# EAGLE design Adafruit ESP32-S3 8MB No PSRAM (EAGLE 9.6.2)
COMPANY: ADAFRUIT INDUSTRIES; DRAWN: KTOWN; REV: B

## Sheet 1 of 2
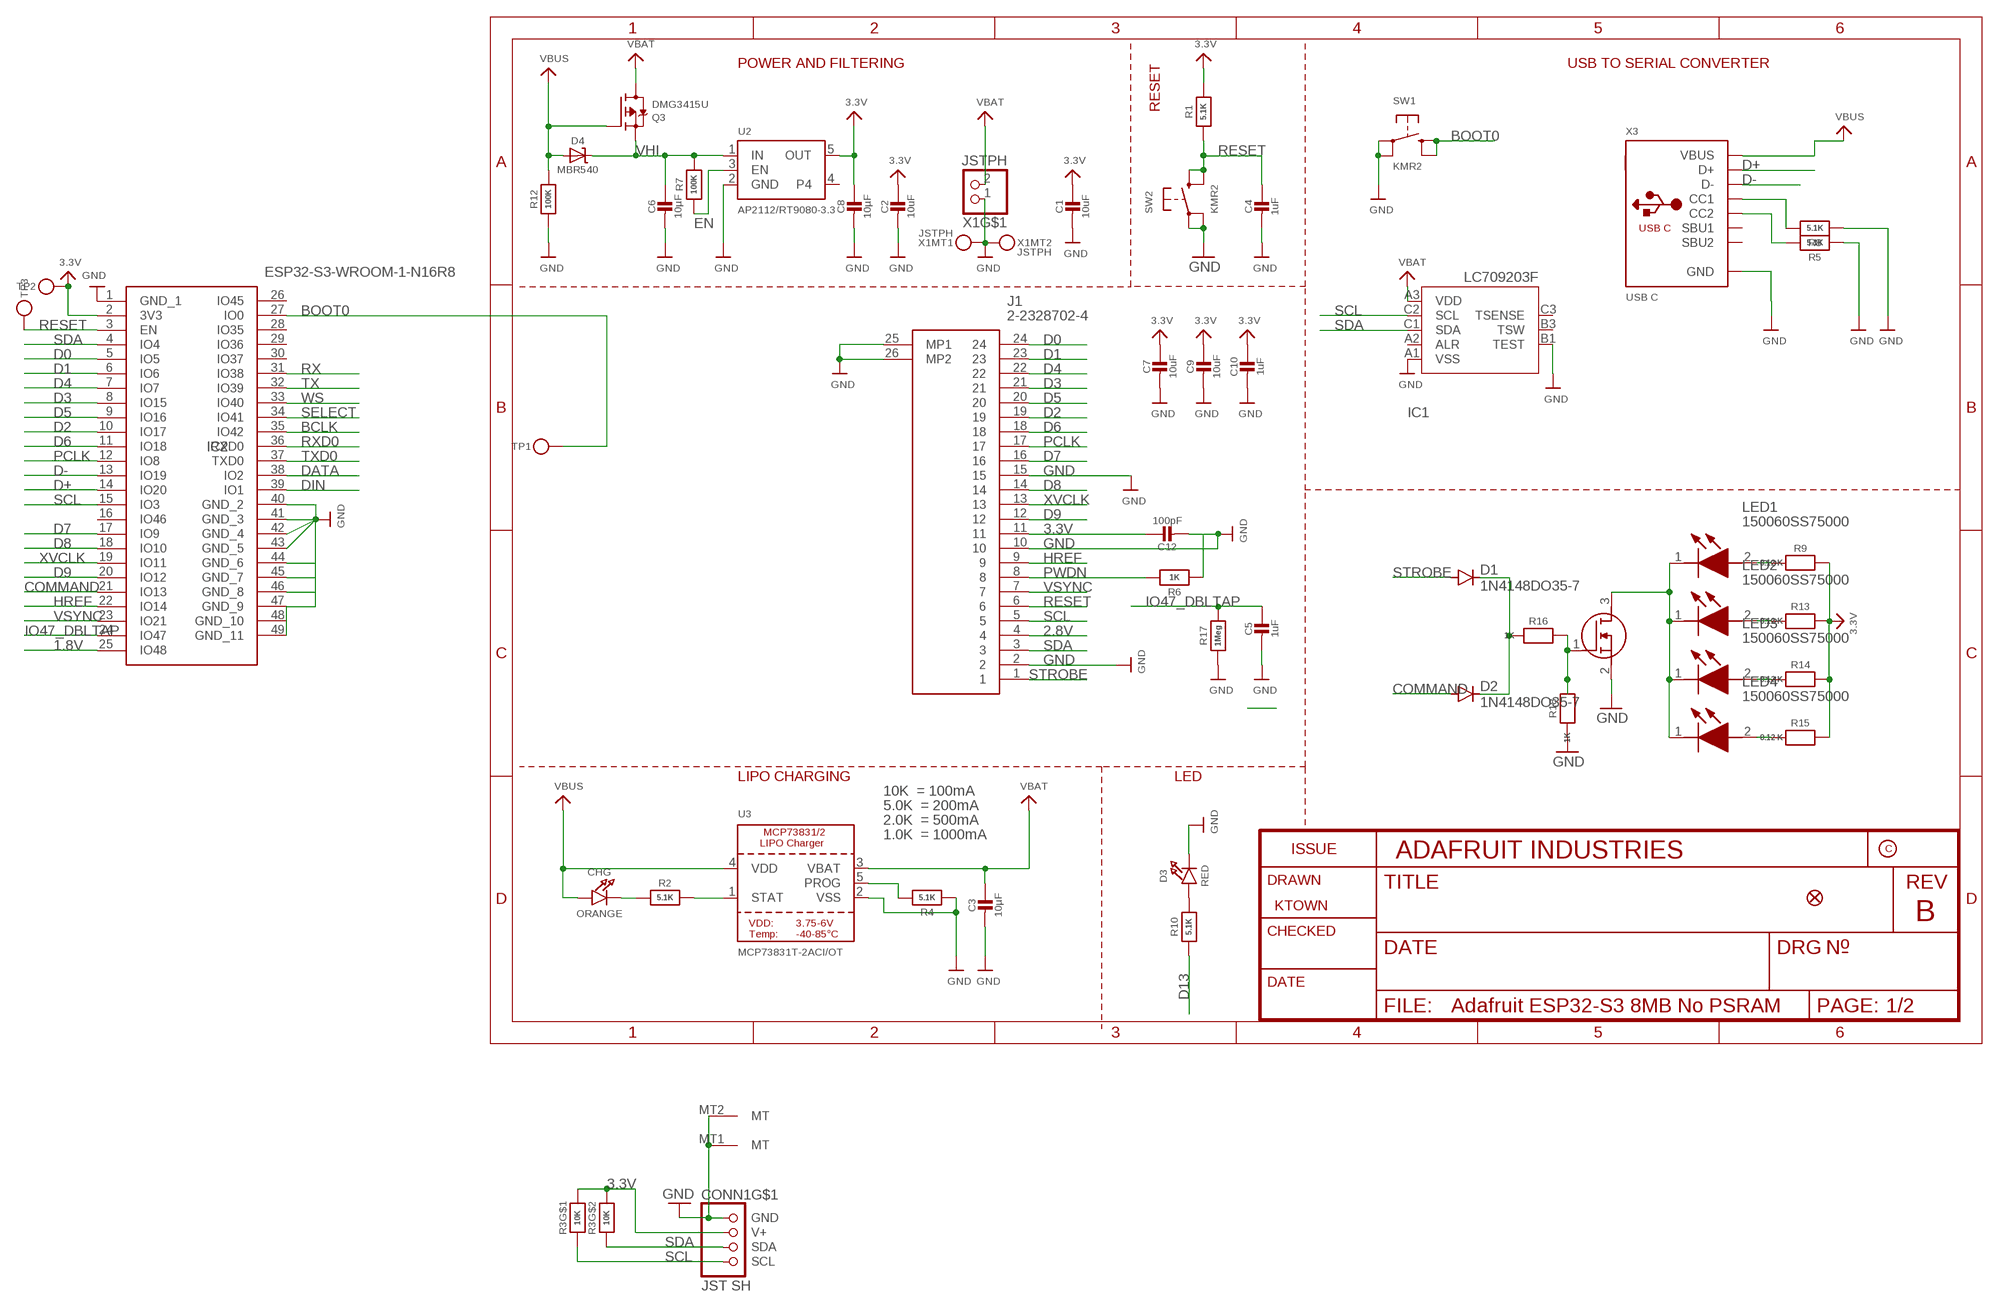
[diagram p0: schematic, sheet 1]

### Parts
C1  10uF  CAP_CERAMIC0805-NOOUTLINE  [0805-NO]
C2  10uF  CAP_CERAMIC0805-NOOUTLINE  [0805-NO]
C3  10µF  CAP_CERAMIC0805-NOOUTLINE  [0805-NO]
C4  1uF  CAP_CERAMIC0603_NO  [0603-NO]
C5  1uF  CAP_CERAMIC0603_NO  [0603-NO]
C6  10µF  CAP_CERAMIC0805-NOOUTLINE  [0805-NO]
C7  10uF  CAP_CERAMIC0805-NOOUTLINE  [0805-NO]
C8  10µF  CAP_CERAMIC0805-NOOUTLINE  [0805-NO]
C9  10uF  CAP_CERAMIC0805-NOOUTLINE  [0805-NO]
C10  1uF  CAP_CERAMIC0603_NO  [0603-NO]
C12  100pF  CAP_CERAMIC0805-NOOUTLINE  [0805-NO]
CHG  ORANGE  LED0603_NOOUTLINE  [CHIPLED_0603_NOOUTLINE]
CONN1  JST SH  STEMMA_I2C_QTRA  [JST_SH4_RA]
D1  1N4148DO35-7  [DO35-7]
D2  1N4148DO35-7  [DO35-7]
D3  RED  LED0603_NOOUTLINE  [CHIPLED_0603_NOOUTLINE]
D4  MBR540  DIODE-SCHOTTKYSOD-123  [SOD-123]
IC1  LC709203F/MH  [WLCSP9]
IC2  ESP32-S3-WROOM-1-N16R8  [ESP32S3WROOM1N16R8]
J1  2-2328702-4  [223287024]
LED1  150060SS75000  [LEDC1608X80N]
LED2  150060SS75000  [LEDC1608X80N]
LED3  150060SS75000  [LEDC1608X80N]
LED4  150060SS75000  [LEDC1608X80N]
Q2  2N7002  [SOT96P240X120-3N]
Q3  DMG3415U  MOSFET-P  [SOT23-R]
R1  5.1K  RESISTOR_0603_NOOUT  [0603-NO]
R2  5.1K  RESISTOR_0603_NOOUT  [0603-NO]
R3  10K  RESISTOR_4PACK  [RESPACK_4X0603]
R4  5.1K  RESISTOR_0603_NOOUT  [0603-NO]
R5  5.1K  RESISTOR_0603_NOOUT  [0603-NO]
R6  1K  RESISTOR_0603_NOOUT  [0603-NO]
R7  100K  RESISTOR_0603_NOOUT  [0603-NO]
R8  5.1K  RESISTOR_0603_NOOUT  [0603-NO]
R9  0.12 K  RESISTOR_0603_NOOUT  [0603-NO]
R10  5.1K  RESISTOR_0603_NOOUT  [0603-NO]
R12  100K  RESISTOR_0603_NOOUT  [0603-NO]
R13  0.12 K  RESISTOR_0603_NOOUT  [0603-NO]
R14  0.12 K  RESISTOR_0603_NOOUT  [0603-NO]
R15  0.12 K  RESISTOR_0603_NOOUT  [0603-NO]
R16  1K  RESISTOR_0603_NOOUT  [0603-NO]
R17  1Meg  RESISTOR_0603_NOOUT  [0603-NO]
R18  1K  RESISTOR_0603_NOOUT  [0603-NO]
SW1  KMR2  SWITCH_TACT_SMT4.6X2.8  [BTN_KMR2_4.6X2.8]
SW2  KMR2  SWITCH_TACT_SMT4.6X2.8  [BTN_KMR2_4.6X2.8]
TP1  TESTPOINTROUND1.5MMNO  [TESTPOINT_ROUND_1.5MM_NO]
TP2  TESTPOINTROUND1.5MMNO  [TESTPOINT_ROUND_1.5MM_NO]
TP3  TESTPOINTROUND1.5MMNO  [TESTPOINT_ROUND_1.5MM_NO]
U2  AP2112/RT9080-3.3  VREG_SOT23-5  [SOT23-5]
U3  MCP73831T-2ACI/OT  MCP73831/2  [SOT23-5]
U$34  FIDUCIAL_1MM  [FIDUCIAL_1MM]
X1  JSTPH  CON_JST_PH_2PIN_MT_BATT  [JSTPH2_BATT]
X3  USB C  USB_C  [USB_C_CUSB31-CFM2AX-01-X]

### Nets
1.8V: IC2.25(IO48)
2.8V: J1.4 ; also sheet 2
3.3V: C1.1 C2.1 C7.1 C8.1 C9.1 C10.1 C12.1 CONN1.2(V+) IC2.2(3V3) J1.11 R1.2 R3.7 R3.8 R9.2 R13.2 R14.2 R15.2 TP2.P$1 U2.5(OUT) ; also sheet 2
BCLK: IC2.35(IO42) ; also sheet 2
BOOT0: IC2.27(IO0) SW1.B'(S1) SW1.B(S) TP1.P$1
COMMAND: D2.A IC2.21(IO13)
D0: IC2.5(IO5) J1.24
D1: IC2.6(IO6) J1.23
D2: IC2.10(IO17) J1.19
D3: IC2.8(IO15) J1.21
D4: IC2.7(IO7) J1.22
D5: IC2.9(IO16) J1.20
D6: IC2.11(IO18) J1.18
D7: IC2.17(IO9) J1.16
D8: IC2.18(IO10) J1.14
D9: IC2.20(IO12) J1.12
D13: R10.1
D+: IC2.14(IO20) X3.A6(D+) X3.B6(D+)
D-: IC2.13(IO19) X3.A7(D-) X3.B7(D-)
DATA: IC2.38(IO2) ; also sheet 2
DIN: IC2.39(IO1) ; also sheet 2
EN: R7.1 U2.3(EN)
GND: C1.2 C2.2 C3.2 C4.2 C5.2 C6.2 C7.2 C8.2 C9.2 C10.2 C12.2 CONN1.1(GND) CONN1.MT1(MT) CONN1.MT2(MT) D3.C IC1.A1(VSS) IC1.B1(TEST) IC2.1(GND_1) IC2.40(GND_2) IC2.41(GND_3) IC2.42(GND_4) IC2.43(GND_5) IC2.44(GND_6) IC2.45(GND_7) IC2.46(GND_8) IC2.47(GND_9) IC2.48(GND_10) IC2.49(GND_11) J1.2 J1.10 J1.15 J1.25(MP1) J1.26(MP2) Q2.2(S) R4.1 R5.1 R6.1 R8.1 R12.1 R17.1 R18.1 SW1.A'(P1) SW1.A(P) SW2.A'(P1) SW2.A(P) U2.2(GND) U3.2(VSS) X1.1 X1.NC1 X1.NC2 X3.A1B12(GND) X3.B1A12(GND) ; also sheet 2
HREF: IC2.22(IO14) J1.9
IO47_DBLTAP: C5.1 IC2.24(IO47) R17.2
N$1: CHG.C R2.1
N$2: LED1.2(A) R9.1
N$3: R2.2 U3.1(STAT)
N$4: R4.2 U3.5(PROG)
N$5: D3.A R10.2
N$8: R8.2 X3.A5(CC1)
N$9: R5.2 X3.B5(CC2)
N$10: LED2.2(A) R13.1
N$11: LED3.2(A) R14.1
N$12: LED4.2(A) R15.1
N$13: LED1.1(K) LED2.1(K) LED3.1(K) LED4.1(K) Q2.3(D)
N$14: D1.C D2.C R16.1
N$15: Q2.1(G) R16.2 R18.2
PCLK: IC2.12(IO8) J1.17
PWDN: J1.8 R6.2
RESET: C4.1 IC2.3(EN) J1.6 R1.1 SW2.B'(S1) SW2.B(S) TP3.P$1
RX: IC2.31(IO38) ; also sheet 2
RXD0: IC2.36(RXD0) ; also sheet 2
SCL: CONN1.4(SCL) IC1.C2(SCL) IC2.15(IO3) J1.5 R3.1
SDA: CONN1.3(SDA) IC1.C1(SDA) IC2.4(IO4) J1.3 R3.2
SELECT: IC2.34(IO41) ; also sheet 2
STROBE: D1.A J1.1
TX: IC2.32(IO39) ; also sheet 2
TXD0: IC2.37(TXD0) ; also sheet 2
VBAT [Power]: C3.1 IC1.A3(VDD) Q3.3(D) U3.3(VBAT) X1.2
VBUS [Power]: CHG.A D4.A Q3.1(G) R12.2 U3.4(VDD) X3.A4B9(VBUS) X3.B4A9(VBUS)
VHI [Power]: C6.1 D4.C Q3.2(S) R7.2 U2.1(IN)
VSYNC: IC2.23(IO21) J1.7
WS: IC2.33(IO40) ; also sheet 2
XVCLK: IC2.19(IO11) J1.13
Unconnected: IC1.A2(ALR) IC1.B3(TSW) IC1.C3(TSENSE) IC2.16(IO46) IC2.26(IO45) IC2.28(IO35) IC2.29(IO36) IC2.30(IO37) R3.3 R3.4 R3.5 R3.6 U2.4 X3.A8(SBU1) X3.B8(SBU2)

### Notes on the sheet
- POWER AND FILTERING | USB TO SERIAL CONVERTER
- RESET
- LIPO CHARGING | LED
- 10K  = 100mA
- 5.0K  = 200mA
- 2.0K  = 500mA
- 1.0K  = 1000mA

## Sheet 2 of 2
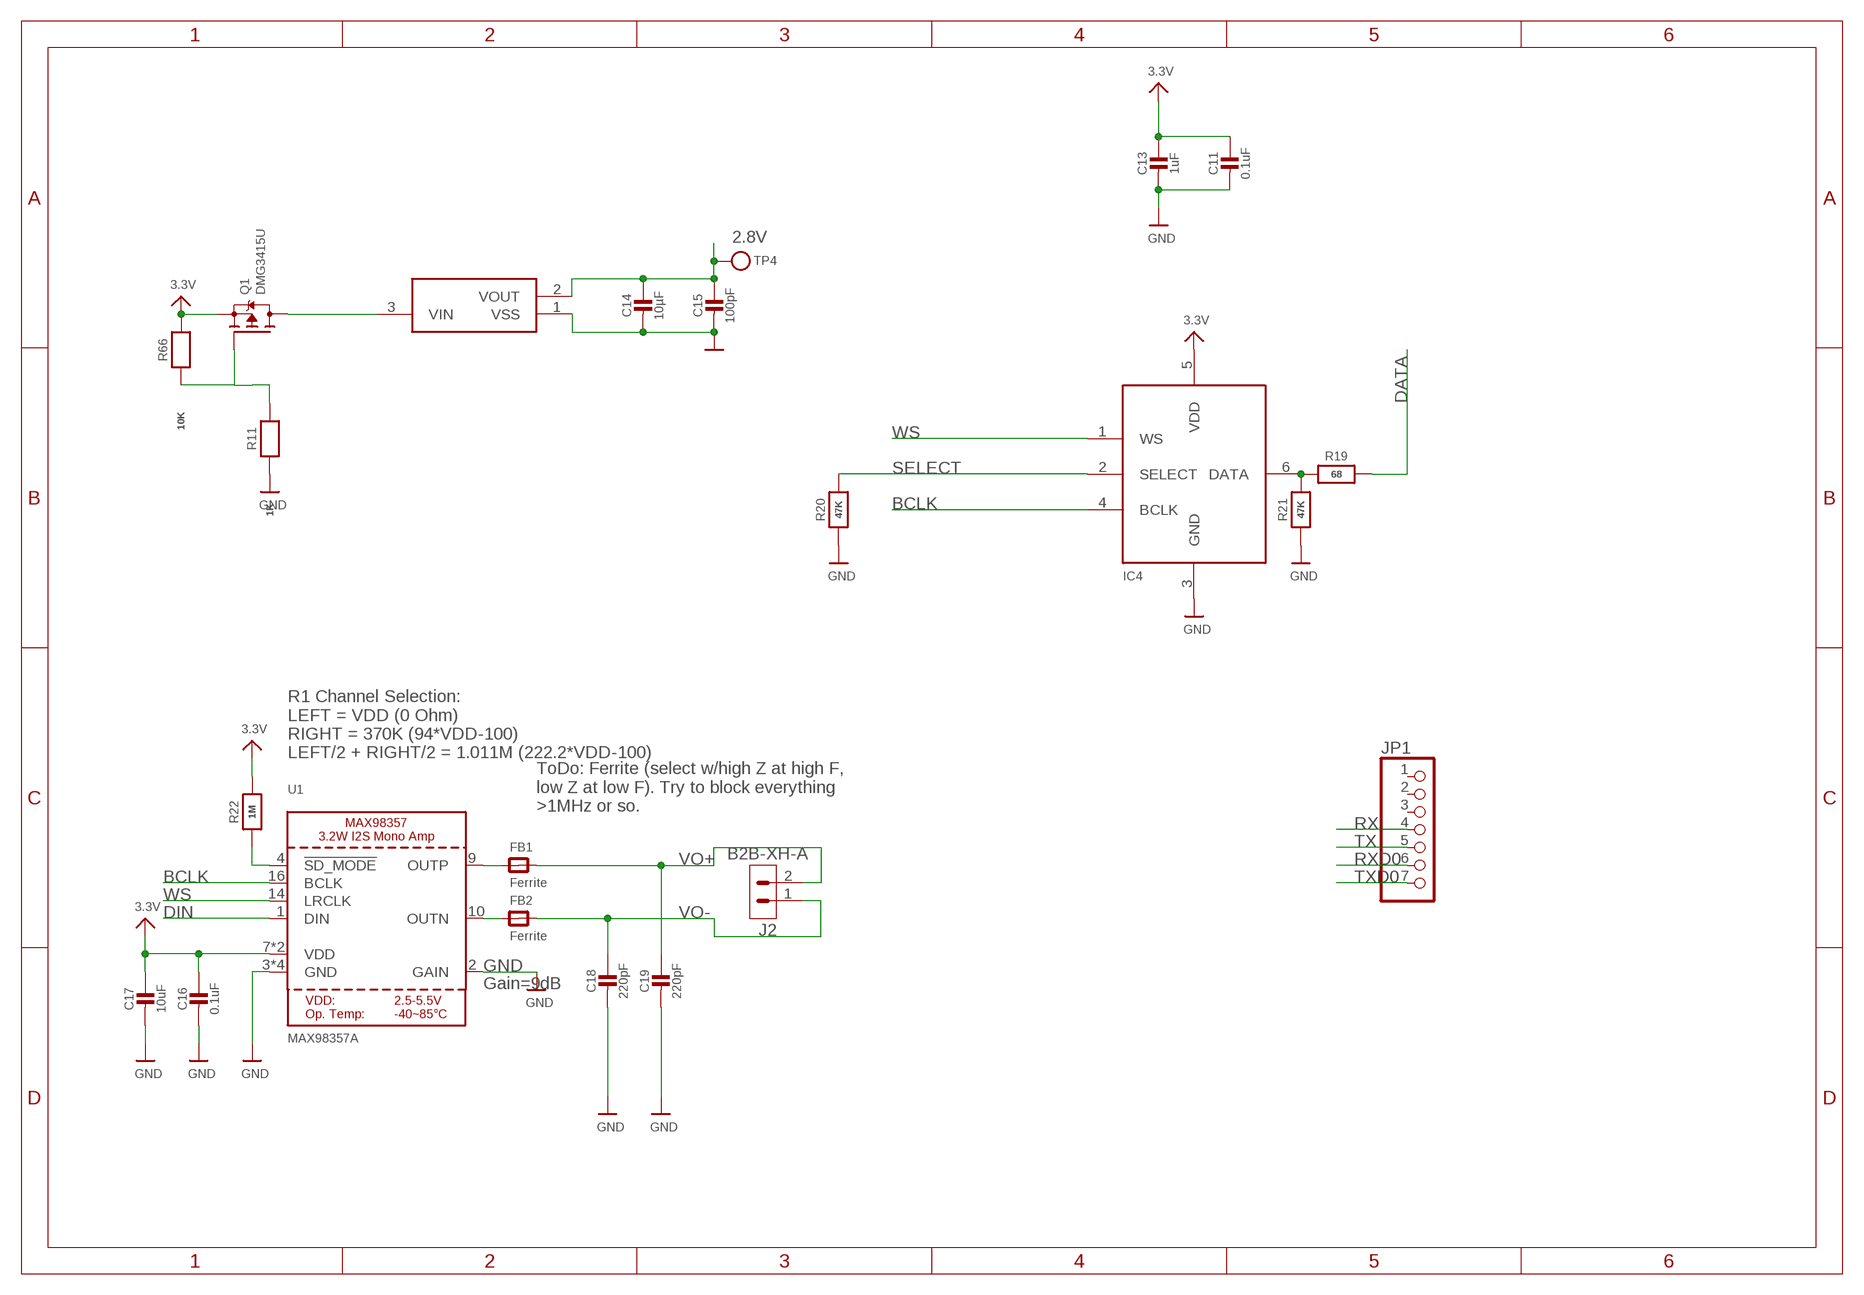
[diagram p1: schematic, sheet 2]

### Parts
C11  0.1uF  CAP_CERAMIC0603_NO  [0603-NO]
C13  1uF  CAP_CERAMIC0603_NO  [0603-NO]
C14  10µF  CAP_CERAMIC0805-NOOUTLINE  [0805-NO]
C15  100pF  CAP_CERAMIC0805-NOOUTLINE  [0805-NO]
C16  0.1uF  CAP_CERAMIC0805-NOOUTLINE  [0805-NO]
C17  10uF  CAP_CERAMIC0805-NOOUTLINE  [0805-NO]
C18  220pF  CAP_CERAMIC0805-NOOUTLINE  [0805-NO]
C19  220pF  CAP_CERAMIC0805-NOOUTLINE  [0805-NO]
FB1  Ferrite  FERRITE-0805NO  [0805-NO]
FB2  Ferrite  FERRITE-0805NO  [0805-NO]
IC3  XC6206P282MR-G  [SOT95P280X130-3N]
IC4  ICS-43434  MIC_I2S_SPH0645  [SPH0645LM4H]
J2  B2B-XH-A  [B2B-XH-A]
JP1  HEADER-1X7THICKER  [1X07_ROUND_76]
Q1  DMG3415U  MOSFET-P  [SOT23-R]
R11  1K  RESISTOR_0603_NOOUT  [0603-NO]
R19  68  RESISTOR_0603_NOOUT  [0603-NO]
R20  47K  RESISTOR_0603_NOOUT  [0603-NO]
R21  47K  RESISTOR_0603_NOOUT  [0603-NO]
R22  1M  RESISTOR0805_NOOUTLINE  [0805-NO]
R66  10K  RESISTOR_0603_NOOUT  [0603-NO]
TP4  TESTPOINTROUND1.5MMNO  [TESTPOINT_ROUND_1.5MM_NO]
U1  MAX98357A  AUDIOAMP_MAX98357  [QFN16_3MM]

### Nets
2.8V: C14.1 C15.1 IC3.2(VOUT) TP4.P$1 ; also sheet 1
3.3V: C11.1 C13.1 C16.1 C17.1 IC4.5(VDD) Q1.2(S) R22.2 R66.2 U1.7(VDD) U1.8(VDD) ; also sheet 1
BCLK: IC4.4(BCLK) U1.16(BCLK) ; also sheet 1
DATA: R19.2 ; also sheet 1
DIN: U1.1(DIN) ; also sheet 1
GND: C11.2 C13.2 C14.2 C15.2 C16.2 C17.2 C18.2 C19.2 IC3.1(VSS) IC4.3(GND) R11.1 R20.1 R21.1 U1.2(GAIN) U1.3(GND) U1.11(GND) U1.15(GND) U1.THERMAL(GND) ; also sheet 1
N$6: Q1.1(G) R11.2 R66.1
N$7: IC3.3(VIN) Q1.3(D)
N$17: IC4.6(DATA) R19.1 R21.2
N$18: FB2.1 U1.10(OUTN)
N$19: FB1.1 U1.9(OUTP)
RX: JP1.4 ; also sheet 1
RXD0: JP1.6 ; also sheet 1
SD_MODE: R22.1 U1.4(!SD_MODE)
SELECT: IC4.2(SELECT) R20.2 ; also sheet 1
TX: JP1.5 ; also sheet 1
TXD0: JP1.7 ; also sheet 1
VO+: C19.1 FB1.2 J2.2
VO-: C18.1 FB2.2 J2.1
WS: IC4.1(WS) U1.14(LRCLK) ; also sheet 1
Unconnected: JP1.1 JP1.2 JP1.3

### Notes on the sheet
- R1 Channel Selection:
  LEFT = VDD (0 Ohm)
  RIGHT = 370K (94*VDD-100)
  LEFT/2 + RIGHT/2 = 1.011M (222.2*VDD-100)
- ToDo: Ferrite (select w/high Z at high F,
  low Z at low F). Try to block everything
  >1MHz or so.
- Gain=9dB

## Library data of the parts
C1-C7 C9-C19 = microbuilder:CAP_CERAMIC: Ceramic Capacitors For new designs, use the packages preceded by an '_' character since they are more reliable: The following footprints should be used on most boards: _0402 - Standard footprint for regular board layouts _0603 - Standard footprint for regular board layouts _0805 - Standard footprint for regular board layouts _1206 - Standard footprint for regular board layouts For extremely tight-pitch boards where space is at a premium, the following 'micro-pitch' footprints can be used (smaller pads, no silkscreen outline, etc.): _0402MP - Micro-pitch footprint for very dense/compact boards _0603MP - Micro-pitch footprint for very dense/compact boards _0805MP - Micro-pitch footprint for very dense/compact boards _1206MP - Micro-pitch footprint for very dense/compact boards
C8 = microbuilder:CAP_CERAMIC: Ceramic Capacitors For new designs, use the packages preceded by an '_' character since they are more reliable: The following footprints should be used on most boards: _0402 - Standard footprint for regular board layouts _0603 - Standard footprint for regular board layouts _0805 - Standard footprint for regular board layouts _1206 - Standard footprint for regular board layouts For extremely tight-pitch boards where space is at a premium, the following 'micro-pitch' footprints can be used (smaller pads, no silkscreen outline, etc.): _0402MP - Micro-pitch footprint for very dense/compact boards _0603MP - Micro-pitch footprint for very dense/compact boards _0805MP - Micro-pitch footprint for very dense/compact boards _1206MP - Micro-pitch footprint for very dense/compact boards; REV: C
CHG D3 = microbuilder:LED: LED 0603 - 0603 Surface Mount Package 2mA: Green LED - Low Power (3.9mcd, 2ma, 1.7Vf) - Digikey: 475-2709-2-ND Orange LED - Low Power (9.8mcd, 2ma, 1.8Vf) - Digikey: 475-1194-2-ND Red LED - Low Power (5mcd, 2ma, 1.8Vf) - Digikey: 475-1195-2-ND Yellow LED - Low Power (7mcd, 2ma, 1.8Vf) - Digikey: 475-1196-2-ND 5mA: Blue LED - Low Power (17mcd, 5ma, 2.9Vf) - Digikey: LNJ937W8CRACT-ND 0805 - 0805 Surface Mount Package 2mA: Red LED (8.8mcd, 2mA, 1.8Vf, Clear) - Low Power [Digikey: 475-2510-1-ND] Green LED (5mcd, 2mA, 1.8Vf, Clear) - Low Power [Digikey: 475-2730-1-ND] Yellow LED (11.3mcd, 2mA, 1.8Vf, Clear) - Low Power [Digikey: 475-2555-1-ND] 20mA: Red LED (104mcd, 20mA, Diffused) - LS R976 [Digikey: 475-1278-6-ND] Red LED (12mcd, 20mA, 2.0Vf, Clear) - APT2012EC [Digikey: 754-1128-1-ND] Green LED (15mcd, 20mA, 2.2Vf, Clear) - APT2012GC [Digikey: 754-1131-1-ND] Orange LED (160mcd, 20mA, 2.1Vf, Clear) - APT2012SECK [Digikey: 754-1130-1-ND] 1206 - 1206 Surface Mount Package Green LED (26mcd, 20mA, Diffused) - LG N971 [Digikey: 475-1407-6-ND] Red LED (15mcd, 20mA, Diffused) - LH N974 [Digikey: 475-1416-6-ND] Cree - Cree High-Power Surface Mount LEDs XPEBWT-L1-0000-00D50 - White 111lm 350mA 2.9Vf 6200K 110° XTEAWT-00-0000-00000LEE3 - White 114lm 350mA 2.85Vf 5000K 115° Everlight - Everlight 45-21 Series Surface Mount LEDs 45-21/QK2C-B2832AC2CB2/2T - Warm White 2000mcd 20mA 3.25Vf 3050K 120° 45-21/LK2C-B38452C4CB2/2T - Nuetral White 2000mcd 20mA 3.25Vf 4150K 120° 45-21/LK2C-B50634C6CB2/2T - Cold White 2200mcd 20mA 3.25Vf 5650K 120° PLCC2 Reverse Mount LS T77K-J1L2-1-0-2-R18-Z - Red 11.25mcd 2mA 1.8Vf 630nm 120° LO T77K-L1M2-24-Z - Orange 19.6mcd 2mA 1.8Vf 606nm 120° LY T77K-K2M1-26-Z - Yellow 15.7mcd 2mA 1.8Vf 587nm 120°
CONN1 = microbuilder:STEMMA_I2C
D1 D2 = diode:1N4148: DIODE high speed (Philips)
D4 = microbuilder:DIODE-SCHOTTKY
FB1 FB2 = microbuilder:FERRITE: Ferrite Bead 0603 MMZ1608B121C - 120 Ohm @ 100MHz, 600mA, 0.15 Ohm DC Resistance - Digikey: 445-2164-1-ND BK1608HW121-T - 120 Ohm, 600mA Ferrite Chip - Digikey: 587-1876-2-ND 0805 HZ0805B272R-10 - 2.7K Ohm @ 100MHz, 200mA, 0.8 Ohm DC Resistance - Digikey: 240-2504-1-ND (see also Murata BLM21BD272SN1L) MMZ2012Y152B - 1.5K Ohm @ 100MHz, 500mA, 0.4 Ohm DC Resistance - Digikey: 445-1560-1-ND - Mainly for high frequency (80-400MHz) MMZ2012R102A - 1K Ohm @ 100MHz, 500mA, 0.3 Ohm DC Resistance - Digikey: 445-1555-2-ND - More general purpose (10-200MHz)
IC1 = adafruit_sensor:LC709203F
IC2 = SamacSys_Parts:ESP32-S3-WROOM-1-N16R8: Multiprotocol Modules SMD Module, ESP32-S3R8, 3.3V, 8 MB Octal PSRAM Die, 16 MB Quad SPI Flash, PCB Antenna Source: Datasheet <https://www.espressif.com/sites/default/files/documentation/esp32-s3-wroom-1_wroom-1u_datasheet_en.pdf>; DESCRIPTION: Multiprotocol Modules SMD Module, ESP32-S3R8, 3.3V, 8 MB Octal PSRAM Die, 16 MB Quad SPI Flash, PCB Antenna; HEIGHT: 3.25mm; MANUFACTURER_NAME: Espressif Systems; MANUFACTURER_PART_NUMBER: ESP32-S3-WROOM-1-N16R8; MOUSER_PART_NUMBER: 356-ESP32S3WRM1N16R8; MOUSER_PRICE-STOCK: https://www.mouser.co.uk/ProductDetail/Espressif-Systems/ESP32-S3-WROOM-1-N16R8?qs=Li%252BoUPsLEnvQc9gW6AMhZg%3D%3D
IC3 = SamacSys_Parts:XC6206P282MR-G: LDO Voltage Regulators 1uA Low Quiescent 3 Terminal, Low ESR Cap. Compatible, Voltage Regulator Source: Datasheet <https://www.torexsemi.com/file/xc6206/XC6206.pdf>; DESCRIPTION: LDO Voltage Regulators 1uA Low Quiescent 3 Terminal, Low ESR Cap. Compatible, Voltage Regulator; HEIGHT: 1.3mm; MANUFACTURER_NAME: Torex; MANUFACTURER_PART_NUMBER: XC6206P282MR-G; MOUSER_PART_NUMBER: 865-XC6206P282MR-G; MOUSER_PRICE-STOCK: https://www.mouser.co.uk/ProductDetail/Torex-Semiconductor/XC6206P282MR-G?qs=AsjdqWjXhJ%2Fpd3DOBopSeA%3D%3D
IC4 = microbuilder:MIC_I2S
J1 = SamacSys_Parts:2-2328702-4: 24 Position FPC Connector Contacts, Top and Bottom 0.020" (0.50mm) Surface Mount, Right Angle Source: Datasheet <https://www.te.com/commerce/DocumentDelivery/DDEController?Action=srchrtrv&DocNm=2328702&DocType=Customer Drawing&DocLang=English&DocFormat=pdf&PartCntxt=2-2328702-4>; DESCRIPTION: 24 Position FPC Connector Contacts, Top and Bottom 0.020" (0.50mm) Surface Mount, Right Angle; HEIGHT: 1.21mm; MANUFACTURER_NAME: TE Connectivity; MANUFACTURER_PART_NUMBER: 2-2328702-4; MOUSER_PART_NUMBER: 571-2-2328702-4; MOUSER_PRICE-STOCK: https://www.mouser.co.uk/ProductDetail/TE-Connectivity/2-2328702-4?qs=P1JMDcb91o4XHtVyXYd2Ug%3D%3D
J2 = Connector:B2B-XH-A: XH Connector Top Entry - 2POS Reference: : Datasheet <http://www.jst-mfg.com/product/pdf/eng/eXH.pdf>; CATEGORY: Connectors; DATASHEET: https://www.jst-mfg.com/product/pdf/eng/eXH.pdf; DESCRIPTION: Connector Header Through Hole 2 position 0.098" (2.50mm); MANUFACTURER: JST Sales America Inc.; MPN: B2B-XH-A; OPERATING_TEMPERATURE: -25°C ~ 85°C; PACKAGE_SIZE: NA; PACKAGE_TYPE: Through Hole; PART_STATUS: Active; PITCH: 0.098" (2.50mm); ROHS: Compliant; SERIES: XH; SUBCATEGORY: Rectangular Connectors; TYPE: Male Headers
JP1 = microbuilder:HEADER-1X7: PIN HEADER
LED1-LED4 = SamacSys_Parts:150060SS75000: WL-SMCW SMT Mono-Color Chip LED Waterclear 0603, Super Red Typ.(@20mA): 630nm, 60mcd, 1.9V, 140 AlInGaP Source: Datasheet <https://www.we-online.com/catalog/datasheet/150060SS75000.pdf>; DESCRIPTION: WL-SMCW SMT Mono-Color Chip LED Waterclear 0603, Super Red Typ.(@20mA): 630nm, 60mcd, 1.9V, 140 AlInGaP; HEIGHT: 0.8mm; MANUFACTURER_NAME: Wurth Elektronik; MANUFACTURER_PART_NUMBER: 150060SS75000; MOUSER_PART_NUMBER: 710-150060SS75000; MOUSER_PRICE-STOCK: https://www.mouser.co.uk/ProductDetail/Wurth-Elektronik/150060SS75000?qs=LlUlMxKIyB0oQaxwspeTEA%3D%3D
Q1 Q3 = microbuilder:MOSFET-P: P-Channel Mosfet LEGEND VDS: Voltage Drain-Source ID: Drain Current RDS(ON): Drain-Source On-State Resistance VGS(TH): Gate-Source Threshold Voltage CISS: Drain-Source Input Capacitance SOT-23 Name VDS ID RDS(ON) VGS(TH) CISS Order Number IRLML5103 30V 760mA 600 mOhm -- 75pF @ 25V Digikey: IRLML5103PBFCT-ND IRLML6401 12V 4.3A 50 mOhm 950mV @ 250µA 830pF @ 10V Digikey: IRLML6401PBFTR-ND NTR0202PL 20V 400mA 800 mOhm 2.3V @ 250uA 70pF @ 5V Digikey: NTR0202PLT1GOSTR-ND NTR4101PT1G 20V 1.8A 85 mOhm 1.2V @ 250uA 675pF @ 10V Digikey: NTR4101PT1GOSCT-ND DMP2004K 20V 600mA 900 mOhm 1V @ 250uA 175pF @ 16V Digikey: DMP2004KDICT-ND PMV65XP 20V 3.9A 76 mOhm 950mV @ 1mA 725pF @ 20V Digikey: 568-2358-2-ND TO-252 Name VDS ID RDS(ON) VGS(TH) CISS Order Number AOD417 30V 25A 34 mOhm 3V @ 250µA 920pF @ 15V Digikey: 785-1106-2-ND PowerPak Name VDS ID RDS(ON) VGS(TH) CISS Order Number AON7401 30V 12A 14 mOhm 3V @ 250µA 2600pF @ 15V Digikey: 785-1302-1-ND
Q2 = SamacSys_Parts:2N7002: Voltage controlled small signal switch.; High density cell design for extremely low RDS(ON).; Rugged and Reliable.; High saturation current capability. Source: Datasheet <https://www.onsemi.com/pub/Collateral/NDS7002A-D.PDF>; DESCRIPTION: Voltage controlled small signal switch.; High density cell design for extremely low RDS(ON).; Rugged and Reliable.; High saturation current capability.; HEIGHT: 1.2mm; MANUFACTURER_NAME: onsemi; MANUFACTURER_PART_NUMBER: 2N7002; MOUSER_PART_NUMBER: 512-2N7002; MOUSER_PRICE-STOCK: https://www.mouser.co.uk/ProductDetail/onsemi-Fairchild/2N7002?qs=0dwsXDNhqlz66WJJhrTFjQ%3D%3D
R1 R2 R4-R22 R66 = microbuilder:RESISTOR: Resistors For new designs, use the packages preceded by an '_' character since they are more reliable: The following footprints should be used on most boards: _0402 - Standard footprint for regular board layouts _0603 - Standard footprint for regular board layouts _0805 - Standard footprint for regular board layouts _1206 - Standard footprint for regular board layouts For extremely tight-pitch boards where space is at a premium, the following 'micro-pitch' footprints can be used (smaller pads, no silkscreen outline, etc.): _0402MP - Micro-pitch footprint for very dense/compact boards _0603MP - Micro-pitch footprint for very dense/compact boards _0805MP - Micro-pitch footprint for very dense/compact boards _1206MP - Micro-pitch footprint for very dense/compact boards
R3 = microbuilder:RESISTOR_4PACK: Resistor Packs (4 resistors) 4 x 0603 10K 1/16W - Digikey: YC164J-10KCT-ND
SW1 SW2 = microbuilder:SWITCH_TACT_SMT: SMT Tact Switches 6x6mm - Digikey: P12940SCT-ND KMR2 (4.6x2.8mm) - Digikey: 401-1426-1-ND EVQ-PQHB55 - Light Touch, 160GF (4.5x4.5mm) - Digikey: P8090SCT-ND KMT0 - KMT021 NGJ LHS (etc.) IP68/Waterproof - Digikey: CKN10289CT-ND
TP1-TP4 = microbuilder:TESTPOINT: Test Point Various test points for characterisation and PCB testing TESTPOINT_SMT - Compact Surface Mount Test Point [Digikey: 5016KTR-ND]
U1 = microbuilder:AUDIOAMP_MAX98357: MAX98357 - 3.2W I2S Mono Audio Amp
U2 = microbuilder:VREG_SOT23-5: SOT23-5 Fixed Voltage Regulators Part Current Out V Out V In V Dropout θJA (°C/W) TJ (°C) Digikey Part No. ADP121 150mA 3.3V 3.4-5.5V 0.09V @ 150mA -- -- ADP121-AUJZ33R7CT-ND ADP121 150mA 3.0V 3.1-5.5V 0.09V @ 150mA -- -- ADP121-AUJZ30R7CT-ND ADP122 300mA 3.3V 3.4-5.5V 0.085V @ 300mA -- -- ADP122AUJZ-3.3-R7CT-ND ADP1712 300mA 3.3V 3.5-5.5V 0.17V @ 300mA -- -- ADP1712AUJZ-3.3-R7TR-ND AP7311 (Low Cost) 150mA 3.3V 3.5-6V 0.15V @ 150mA -- -- AP7311-33WG-7DICT-ND LD39015M18R 150mA 1.8V 1.9V-5.5V 0.08V @ 100mA -- -- 497-6977-1-ND LP2985A-33DBVR 150mA 3.3V 3.3-16V 0.28V @ 150mA 206 150 296-18479-1-ND MCP1824T-3302E/OT 300mA 3.3V 3.5V-6V 0.2V @ 300mA -- -- MCP1824T-3302E/OTCT-ND MIC5205-2.5YM5 TR 150mA 2.5V 2.7-16V 0.165V @ 150mA -- -- 576-1257-2-ND MIC5205-3.0YM5 TR 150mA 3.0V 3.2V-16V 0.165V @ 150mA -- -- 576-1258-2-ND MIC5205-3.3YM5 TR 150mA 3.3V 3.5V-16V 0.165V @ 150mA -- -- 576-1259-2-ND TPS780330220 150mA 3.3V+2.2V 3.6-5.5V 250mV Max -- -- 296-23332-1-ND TDA3663/N1,135 100mA 3.3V 3.5-45V 0.18V @ 50mA -- -- 568-5343-1-ND Max operating temp can be calculated using θJA, TJ (max junction temperature), and power in watts. Set the "Maximum Ambient Temperature" until it reaches TJ ("Max Junction Temperature"), which is the absolute limit for safe use of the regulator: Heat Sink Temperature Calculator <http://www.daycounter.com/Calculators/Heat-Sink-Temperature-Calculator.phtml> For example, With 12V source into a 3.3V LP2985 and a 30mA load, we are dissipating (12V-3.3V) * 0.03A = 0.261W. With a θJA of 206 °C/W, a TJ of 150°C, and 261mW we can safely use the chip without a heat sink up to 75°C (=147.1°C Junction Temperature).
U3 = microbuilder:MCP73831/2: MCP73831/2 LIPO Charger VDD: 3.75 - 6V Temp -40 - 85°C Programmable Charge Rate: 15-500mA NOTE: STAT is a tri-state logic output on the MCP73831 and an open-drain output on the MCP73832. SOT23-5 with 4.2V output and tri-state logic on STAT = MCP73831T-2ACI/OT
U$34 = microbuilder:FIDUCIAL: Fiducial Alignment Points Various fiducial points for machine vision alignment.; BOM: EXCLUDE
X1 = adafruit_electromech:CON_JST_PH_2PIN_MT
X3 = adafruit_connector:USB_C: USB Type-C USB 2.0 Connector

## Net classes
2 gnd: width 0.254 mm, drill 0.483 mm
3 Power: width 0.305 mm, drill 0.483 mm

## Board
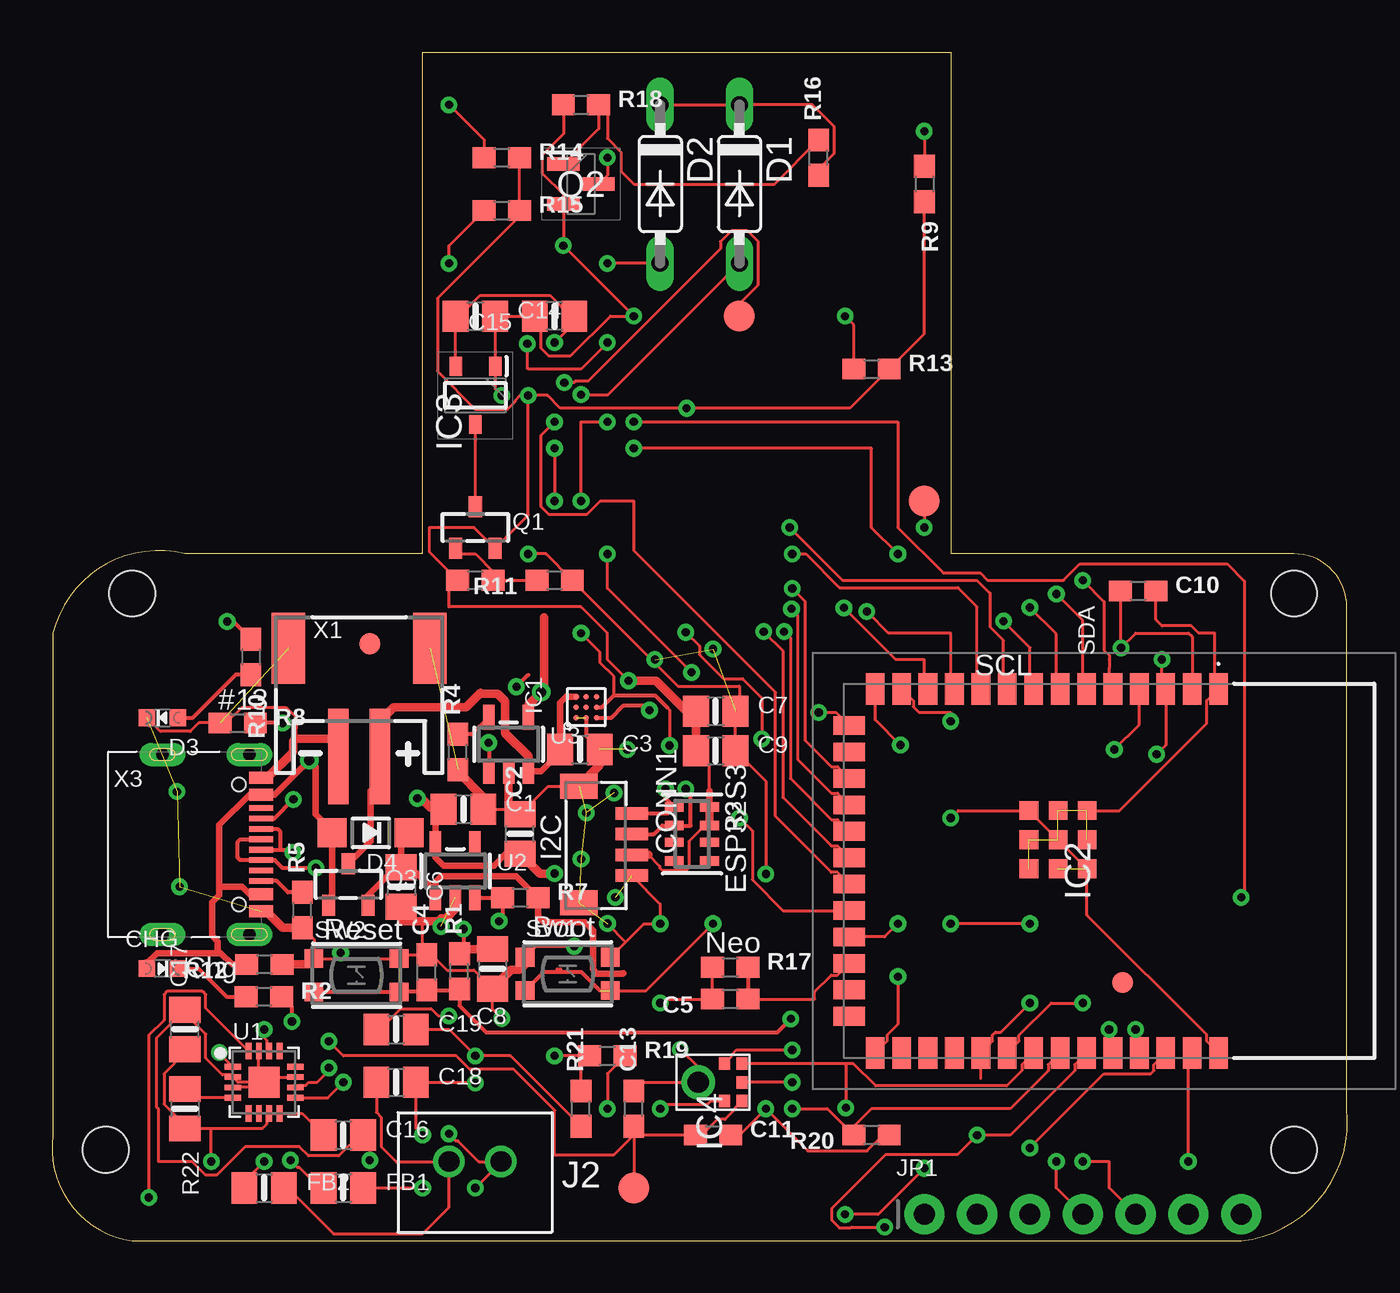
[diagram p2: board, top side]
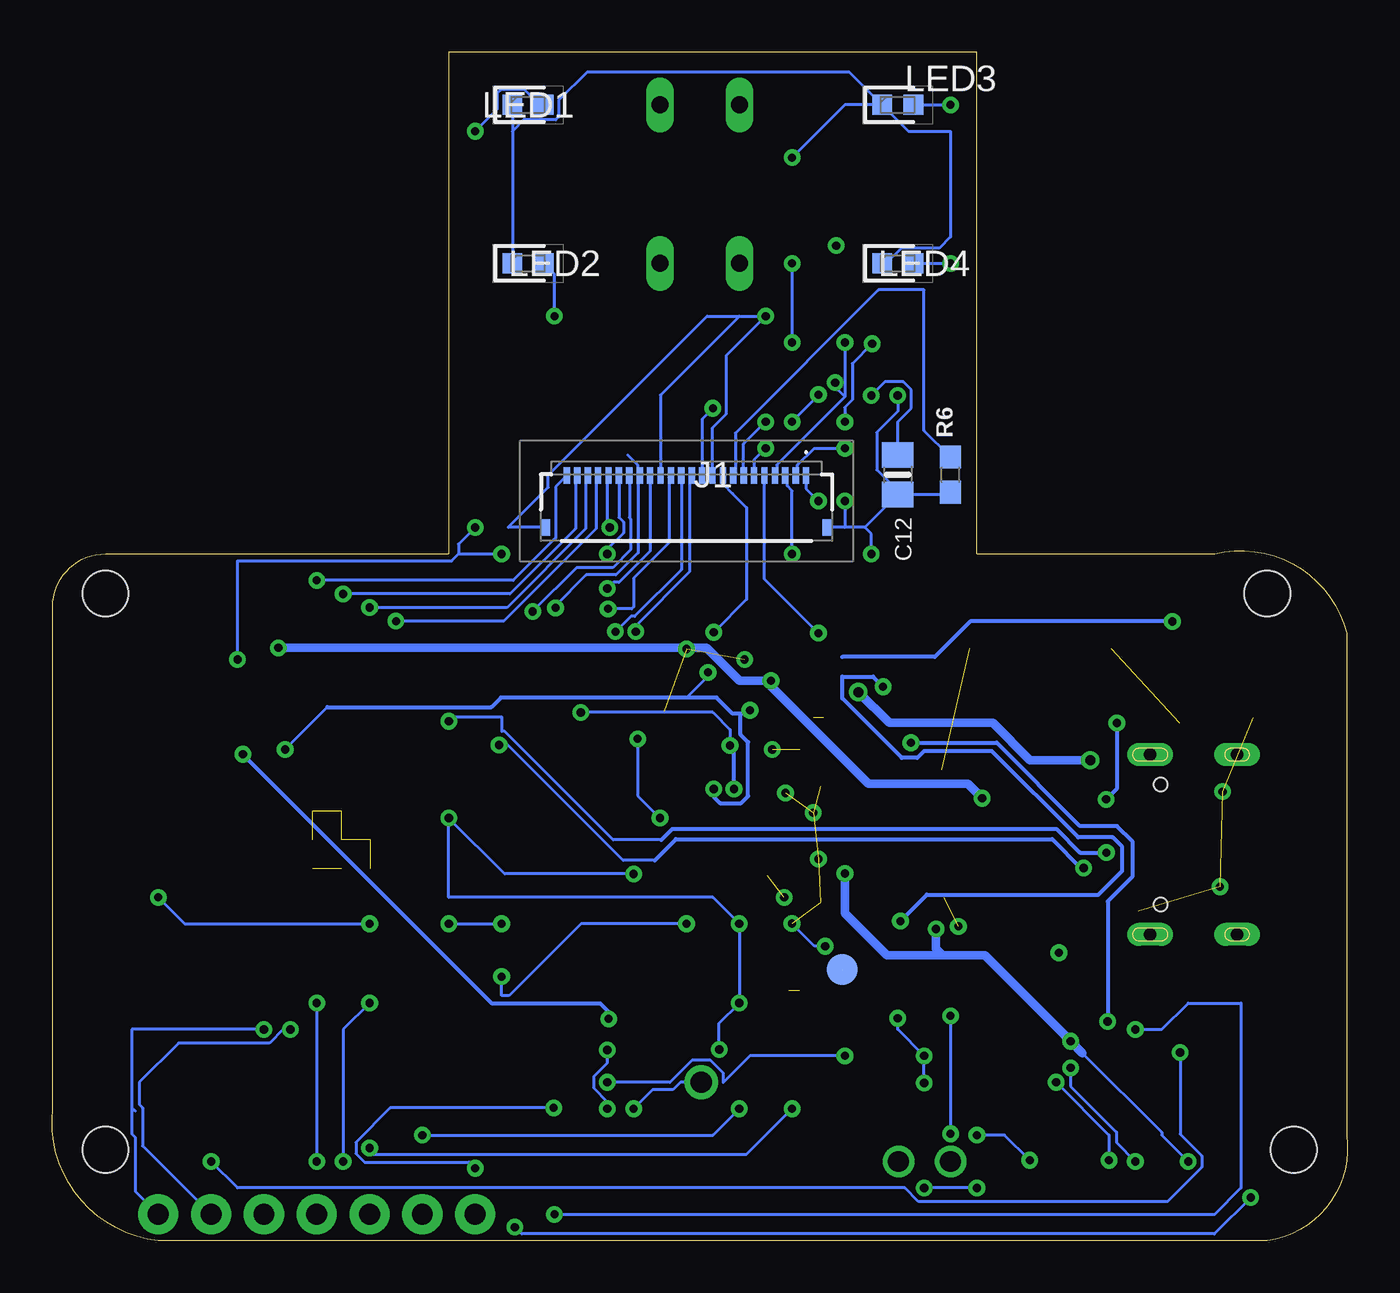
[diagram p3: board, bottom side, seen from below]

Size 62.31 x 57.15 mm. Coordinates in mm from the lower left corner, seen from the top.
Outline: 3.85,0 57.19,0 arc90 62.27,6.35 62.27,30.48 arc90 59.73,33.02 43.22,33.02 43.22,57.15 17.82,57.15 17.82,33.02 6.39,33.02 arc90 0.04,29.21 0.04,5.08 arc90 3.85,0
Copper layers (1*16): Top 0.035mm / dielectric 1.5mm / Bottom 0.035mm
Design rules "adafruit 7-7 *": minimum track width 6mil, minimum drill 15.5mil, track to track 8mil, track to pad 7mil, pad to pad 7mil, via to via 7mil, smd to smd 7mil, copper to edge 10mil, drill to drill 8mil, minimum pad ring 10mil, minimum via ring 8mil, stop-mask expansion 2mil, vias tented up to drill 20mil, thermal gap 10mil
Holes 2.2 mm at 59.73,4.38 59.73,31.11 2.58,4.38 3.85,31.11

### Footprints (pad centres in the part's own frame; a part is rotated, then mirrored left to right if it is on the bottom)
0805-NO = smd 1.24 x 1.5: 1 -0.95,0; 2 0.95,0
0603-NO = smd 1.1 x 1: 1 -0.85,0; 2 0.85,0
CHIPLED_0603_NOOUTLINE = smd 0.8 x 0.8: A 0,-0.75; C 0,0.75
JST_SH4_RA = smd 0.6 x 1.55: 1 1.5,1.686; 2 0.5,1.686; 3 -0.5,1.686; 4 -1.5,1.686 | smd 1.2 x 1.8: MT1 -2.8,-0.862; MT2 2.8,-0.862
DO35-7 = drill 0.813 long: A 3.81,0; C -3.81,0
SOD-123 = smd 1.4 x 1.4: A 1.85,0; C -1.85,0
WLCSP9 = smd 0.275 x 0.275: A1 -0.5,0.5; A2 0,0.5; A3 0.5,0.5; B1 -0.5,0; B2 0,0; B3 0.5,0; C1 -0.5,-0.5; C2 0,-0.5; C3 0.5,-0.5
ESP32S3WROOM1N16R8 = smd 1.5 x 0.9: 1 -8.75,5.26; 2 -8.75,3.99; 3 -8.75,2.72; 4 -8.75,1.45; 5 -8.75,0.18; 6 -8.75,-1.09; 7 -8.75,-2.36; 8 -8.75,-3.63; 9 -8.75,-4.9; 10 -8.75,-6.17; 11 -8.75,-7.44; 12 -8.75,-8.71; 13 -8.75,-9.98; 14 -8.75,-11.25; 27 8.75,-11.25; 28 8.75,-9.98; 29 8.75,-8.71; 30 8.75,-7.44; 31 8.75,-6.17; 32 8.75,-4.9; 33 8.75,-3.63; 34 8.75,-2.36; 35 8.75,-1.09; 36 8.75,0.18; 37 8.75,1.45; 38 8.75,2.72; 39 8.75,3.99; 40 8.75,5.26 | smd 0.9 x 1.5: 15 -6.985,-12.5; 16 -5.715,-12.5; 17 -4.445,-12.5; 18 -3.175,-12.5; 19 -1.905,-12.5; 20 -0.635,-12.5; 21 0.635,-12.5; 22 1.905,-12.5; 23 3.175,-12.5; 24 4.445,-12.5; 25 5.715,-12.5; 26 6.985,-12.5 | smd 0.9 x 0.9: 41 -1.5,-2.46; 42 -2.9,-1.06; 43 -2.9,-2.46; 44 -2.9,-3.86; 45 -1.5,-3.86; 46 -0.1,-3.86; 47 -0.1,-2.46; 48 -0.1,-1.06; 49 -1.5,-1.06
SOT95P280X130-3N = smd 0.9 x 0.6: 1 -1.4,0.95; 2 -1.4,-0.95; 3 1.4,0
SPH0645LM4H = smd 0.6 x 0.525: 1 -0.9,1.4; 2 -0.9,0.55; 4 0.9,0.55; 5 0.9,1.4; 6 0,1.4 | drill 1.025 pad 1.625: 3 0,-0.71
223287024 = smd 0.3 x 0.8: 1 5.75,1.235; 2 5.25,1.235; 3 4.75,1.235; 4 4.25,1.235; 5 3.75,1.235; 6 3.25,1.235; 7 2.75,1.235; 8 2.25,1.235; 9 1.75,1.235; 10 1.25,1.235; 11 0.75,1.235; 12 0.25,1.235; 13 -0.25,1.235; 14 -0.75,1.235; 15 -1.25,1.235; 16 -1.75,1.235; 17 -2.25,1.235; 18 -2.75,1.235; 19 -3.25,1.235; 20 -3.75,1.235; 21 -4.25,1.235; 22 -4.75,1.235; 23 -5.25,1.235; 24 -5.75,1.235 | smd 0.4 x 0.8: 25 -6.75,-1.265; 26 6.75,-1.265
B2B-XH-A = drill 1: 1 0,0; 2 2.5,0
1X07_ROUND_76 = drill 1 pad 1.93: 1 -7.62,0; 2 -5.08,0; 3 -2.54,0; 4 0,0; 5 2.54,0; 6 5.08,0; 7 7.62,0
LEDC1608X80N = smd 0.95 x 0.95: 1 -0.75,0; 2 0.75,0
SOT23-R = smd 0.635 x 1.016: 1 -0.95,-1; 2 0.95,-1; 3 0,1
SOT96P240X120-3N = smd 1.55 x 0.65: 1 -0.85,0.96; 2 -0.85,-0.96; 3 0.85,0
RESPACK_4X0603 = smd 0.45 x 0.9: 1 -1.3,-0.85; 2 -0.4,-0.85; 3 0.4,-0.85; 4 1.3,-0.85; 5 1.3,0.85; 6 0.4,0.85; 7 -0.4,0.85; 8 -1.3,0.85
BTN_KMR2_4.6X2.8 = smd 0.9 x 0.9: A 2.05,0.8; A' -2.05,0.8; B 2.05,-0.8; B' -2.05,-0.8
TESTPOINT_ROUND_1.5MM_NO = smd 1.5 x 1.5: P$1 0,0
QFN16_3MM = smd 0.8 x 0.28: 1 -1.5,0.75; 2 -1.5,0.25; 3 -1.5,-0.25; 4 -1.5,-0.75; 9 1.5,-0.75; 10 1.5,-0.25; 11 1.5,0.25; 12 1.5,0.75 | smd 0.28 x 0.8: 5 -0.75,-1.5; 6 -0.25,-1.5; 7 0.25,-1.5; 8 0.75,-1.5; 13 0.75,1.5; 14 0.25,1.5; 15 -0.25,1.5; 16 -0.75,1.5 | smd 1.5 x 1.5: THERMAL 0,0
SOT23-5 = smd 0.55 x 1.2: 1 -0.95,-1.3; 2 0,-1.3; 3 0.95,-1.3; 4 0.95,1.3; 5 -0.95,1.3
FIDUCIAL_1MM = smd 1 x 1: 1 0,0
JSTPH2_BATT = smd 1 x 4.6: 1 -1,-3.7; 2 1,-3.7 | smd 1.6 x 3.4: NC1 -3.4,1.5; NC2 3.4,1.5
USB_C_CUSB31-CFM2AX-01-X = smd 0.575 x 1.15: A1B12 -3.2,3.545; A4B9 -2.4,3.545; B1A12 3.2,3.545; B4A9 2.4,3.545 | smd 0.275 x 1.15: A5 -1.25,3.545; A6 -0.25,3.545; A7 0.25,3.545; A8 1.25,3.545; B5 1.75,3.545; B6 0.75,3.545; B7 -0.75,3.545; B8 -1.75,3.545 | drill 0.6 pad 1 long: M1 -4.32,2.97; M2 4.32,2.97; M3 -4.32,-1.21; M4 4.32,-1.21 | hole 0.65: 2.89,2.47; -2.89,2.47

### Placement (x,y rotation side)
C1  19.79,20.75 0 top
C2  22.51,19.56 90 top
C3  25.39,23.62 0 top
C4  18.02,12.9 90 top
C5  32.62,11.62 180 top
C6  16.79,17.01 270 top
C7  31.92,25.46 0 top
C8  21.19,13.07 270 top
C9  31.92,23.56 0 top
C10  52.24,31.24 0 top
C11  31.79,5.08 0 top
C12  21.63,36.83 270 bottom
C13  27.98,6.35 90 top
C14  20.36,44.45 0 top
C15  24.17,44.45 180 top
C16  14.01,5.08 0 top
C17  6.39,10.16 90 top
C18  16.55,7.62 0 top
C19  16.55,10.16 0 top
CHG  5.31,13.08 270 top
CONN1  26.2,19.05 270 top
D1  33.06,50.8 270 top
D2  29.25,50.8 270 top
D3  5.31,25.15 90 top
D4  15.33,19.61 180 top
FB1  14.01,2.54 0 top
FB2  10.2,2.54 0 top
IC1  25.69,25.65 90 top
IC2  50.84,17.78 270 top
IC3  20.36,40.64 270 top
IC4  31.79,7.62 270 top
J1  31.79,35.56 0 bottom
J2  19.09,3.81 0 top
JP1  49.57,1.27 0 top
LED1  39.41,54.61 0 bottom
LED2  39.41,46.99 0 bottom
LED3  21.63,54.61 0 bottom
LED4  21.63,46.99 0 bottom
Q1  20.36,34.29 0 top
Q2  25.44,50.8 0 top
Q3  14.25,17.13 0 top
R1  19.6,12.95 90 top
R2  10.19,11.73 0 top
R3  30.77,19.56 270 top
R4  19.52,23.49 90 top
R5  12.04,15.9 90 top
R6  19.09,36.83 90 bottom
R7  22.52,16.5 0 top
R8  8.93,24.89 0 top
R9  41.95,50.8 270 top
R10  9.57,28.07 270 top
R11  24.17,31.75 180 top
R12  10.21,13.28 180 top
R13  39.41,41.91 0 top
R14  21.63,52.07 0 top
R15  21.63,49.53 0 top
R16  36.87,52.07 90 top
R17  32.62,13.14 0 top
R18  25.44,54.61 0 top
R19  26.71,8.89 0 top
R20  39.41,5.08 180 top
R21  25.44,6.35 90 top
R22  6.39,6.35 270 top
R66  20.36,31.75 180 top
SW1  24.81,12.83 0 top
SW2  14.65,12.76 0 top
TP1  24.3,13.03 0 bottom
TP2  27.98,2.54 0 top
TP3  41.95,35.56 0 top
TP4  33.06,44.45 0 top
U1  10.2,7.62 0 top
U2  19.4,17.78 0 top
U3  21.96,23.88 0 top
U$34  15.28,28.7 270 top
U$35  FIDUCIAL_1MM  [FIDUCIAL_1MM]  51.5,12.43 270 top
X1  14.77,26.99 0 top
X3  6.52,19.05 270 top

### Tracks (layer width: path | path; a pad name or v marks a point on that pad's centre or on a via)
2.8V  (via drill 0.39)
  Top 0.152: IC3.2 C14.1 19.58,44.45 20.59,45.45 23.95,45.45 24.95,44.45 C15.1 25.12,44.13 v24.17,43.18 | v24.64,41.26 25.09,41.26 25.17,41.33 25.79,41.33 32.15,47.69 32.15,48.03 32.68,48.57 33.44,48.57 33.97,48.03 33.97,45.95 33.06,45.04 TP4.P$1
  Bottom 0.152: J1.4 27.44,36.89 27.44,37.3 24.17,40.57 | v24.17,43.18 24.17,40.57 | v24.64,41.26 24.64,41.04 24.17,40.57
3.3V  (via drill 0.39)
  Top 0.152: IC2.2 54.83,29.03 54.65,29.21 52.12,29.21 v51.41,28.5 51.41,31.22 C10.1 | 31.62,21.59 31.62,22.9 C9.1 | R3.7 31.39,19.96 30.63,19.2 30.63,17.93 30.48,17.78 29.37,17.78 29.22,17.93 29.22,18.01 28.68,18.55 | v27.73,26.92 26.71,27.94 26.71,29.21 25.44,30.48 19.09,30.48 19.09,31.33 R66.2 18.15,33.11 18.15,34.29 20.31,34.29 Q1.2 22.9,34.88 v22.9,40.64 | R14.2 R15.2 22.48,49.25 18.54,45.3 18.54,41.8 20.36,39.99 21.9,39.99 22.28,40.37 22.28,40.41 22.52,40.64 v22.9,40.64 | v22.9,40.64 23.83,40.64 24.44,40.02 v30.52,40.02 38.37,40.02 R13.2 41.95,43.6 R9.2 | IC4.5 32.86,6.39 32.86,6.31 32.38,5.83 32,5.83 31.24,5.08 C11.1 28.4,5.08 28.19,5.29 | 28.19,5.29 C13.1 TP2.P$1 | 28.19,5.29 27.04,4.14 24.17,4.14 24.17,6.27 22.2,8.24 20.09,8.24 19.44,8.89 14.01,8.89 v13.31,9.59 | 7.66,5.4 R22.2 6.39,5.57 5.39,6.58 5.39,8.03 6.39,9.03 C17.1 | 7.66,5.4 10.13,5.4 10.34,5.62 10.34,6.01 U1.7 U1.8 12.02,6.12 C16.1 | v7.66,3.81 7.66,5.4
  Top 0.203: v19.79,14.99 19.79,13.99 R1.2
  Top 0.305: C1.1 18.45,20.36 U2.5 18.45,18.43 18.84,18.03 21.25,18.03 21.82,18.61 C2.1 | R3.8 31.62,21.59 31.62,21.63
  Top 0.406: v51.41,28.5 51.45,28.5 | C1.1 18.78,20.81 18.21,20.81 17.76,21.27 v17.57,21.27 | C7.1 C9.1 30.97,24.93 30.93,25.06 29.06,26.92 v27.73,26.92 | v24.17,17.65 23.46,17.65 C2.1 | C8.1 19.82,14.02 R1.2 | CONN1.2 28.68,18.55 | R3.7 R3.8
  Bottom 0.152: C12.1 21.63,39.37 20.98,40.02 20.98,40.91 21.36,41.29 22.25,41.29 v22.9,40.64 | v30.52,40.02 31.04,39.5 J1.11 | 12.74,9.02 8.93,5.21 8.93,5.08 v7.66,3.81
  Bottom 0.203: v27.73,26.92 27.73,26.67
  Bottom 0.406: v51.41,28.5 30.83,28.5 29.25,26.92 v27.73,26.92 | 27.73,26.67 23.03,21.97 18.26,21.97 v17.57,21.27 | v24.17,17.65 24.17,15.75 22.14,13.72 19.47,13.72 | v19.79,14.99 19.79,14.03 19.47,13.72 | 12.74,9.02 v13.31,9.59 17.44,13.72 19.47,13.72
BCLK  (via drill 0.39)
  Top 0.152: IC2.35 49.18,8.46 49.18,8.18 46.09,5.08 v44.49,5.08 43.55,4.14 40.09,4.14 37.49,1.54 37.49,1 37.87,0.62 38.41,0.62 38.45,0.65 v40.04,0.65 | IC4.4 31.69,6.72 31.52,6.55 29.45,6.55 v29.25,6.35 | U1.16 7.39,11.18 7.39,11.84 7.25,11.98 5.54,11.98 5.39,11.84 5.39,10.61 4.66,9.88 v4.66,2.08
  Bottom 0.152: v29.25,6.35 30.52,5.08 v44.49,5.08 | v4.66,2.08 6.4,0.33 6.42,0.33 39.72,0.33 v40.04,0.65
BOOT0  (via drill 0.39)  (2 unrouted)
  Top 0.152: v31.79,15.24 28.58,12.03 SW1.B | IC2.27 40.16,9.6 40.16,9.88 40.68,10.41 v40.68,12.7
  Top 0.203: 24.55,12.92 23.64,12.92 SW1.B' | 24.55,12.92 25.46,12.92 26.35,12.03 | TP1.P$1 24.44,13.03 24.55,12.92
  Bottom 0.152: v31.79,15.24 36.87,15.24 40.33,11.78 40.68,11.78 v40.68,12.7
COMMAND  (via drill 0.39)
  Top 0.152: IC2.21 37.77,17.71 37.49,17.71 34.79,20.4 34.79,26.37 27.98,33.18 27.98,35.56 26.37,35.56 25.71,34.91 23.9,34.91 23.52,35.29 23.52,38.72 v24.17,39.37 | D2.A v26.71,46.99 | v26.71,43.18 25.44,41.91 22.9,41.91 22.86,41.95 v22.86,43.12
  Bottom 0.152: v26.71,46.99 v26.71,43.18 | v22.86,43.12 23.81,42.17 23.81,40.43 24.17,40.07 v24.17,39.37
D0  (via drill 0.39)
  Top 0.152: v49.57,31.75 50.6,30.72 50.6,28.39 50.84,28.15 50.84,27.94 50.84,27.53 50.84,26.71 IC2.5
  Bottom 0.152: J1.24 38.09,36.25 38.09,33.79 40.13,31.75 v49.57,31.75
D1  (via drill 0.39)
  Top 0.152: v48.3,31.1 49.57,29.83 49.57,26.71 IC2.6
  Bottom 0.152: J1.23 37.14,36.7 37.14,34.24 40.28,31.1 v48.3,31.1
D2  (via drill 0.39)
  Top 0.152: v35.6,33.02 36.25,33.02 37.88,31.39 43.58,31.39 44.49,30.48 44.49,26.71 IC2.10
  Bottom 0.152: v35.6,33.02 35.6,33.25 34.83,34.02 34.83,34.56 35.04,34.77 J1.19
D3  (via drill 0.39)
  Top 0.152: v45.76,29.79 47.03,28.52 47.03,26.71 IC2.8
  Bottom 0.152: J1.21 36.14,36.7 36.14,34.23 40.58,29.79 v45.76,29.79
D4  (via drill 0.39)
  Top 0.152: v47.03,30.44 48.3,29.17 48.3,26.71 IC2.7
  Bottom 0.152: J1.22 36.64,36.7 36.64,34.23 40.43,30.44 v47.03,30.44
D5  (via drill 0.39)
  Top 0.152: v35.48,34.29 38.02,31.75 44.49,31.75 45.11,31.13 45.11,29.52 45.76,28.86 45.76,26.71 IC2.9
  Bottom 0.152: J1.20 35.6,36.73 35.6,34.29 v35.48,34.29
D6  (via drill 0.39)
  Top 0.152: v39.19,30.26 40.23,29.21 43.22,29.21 43.22,26.71 IC2.11
  Bottom 0.152: v39.19,30.26 37.08,32.37 35.33,32.37 34.47,33.22 34.47,34.71 34.54,34.78 J1.18
D7  (via drill 0.39)
  Top 0.152: IC2.17 37.77,22.79 37.49,22.79 36.22,24.06 36.22,30.74 v35.6,31.36
  Bottom 0.152: v35.6,31.36 35.3,31.65 35.03,31.65 33.54,33.15 J1.16
D8  (via drill 0.39)
  Top 0.152: v35.56,30.38 35.86,30.08 35.86,23.14 37.49,21.52 37.77,21.52 IC2.18
  Bottom 0.152: J1.14 32.64,36.7 32.64,33.55 34.33,31.86 34.33,30.48 34.43,30.38 v35.56,30.38
D9  (via drill 0.39)
  Top 0.152: v34.23,29.28 35.15,28.36 35.15,21.32 37.49,18.98 37.77,18.98 IC2.20
  Bottom 0.152: J1.12 31.64,36.7 31.64,32.17 34.23,29.58 v34.23,29.28
D13  (via drill 0.39)
  Top 0.203: R10.1 8.71,29.77 v8.42,29.77
  Bottom 0.203: v8.42,29.77 18.15,29.77 19.85,28.07 24.3,28.07
D+  (via drill 0.39)
  Top 0.152: v40.8,23.83 39.59,25.04 IC2.14
  Top 0.203: v12.69,17.92 11.1,17.92 10.72,18.3 X3.B6 9.05,18.3 8.93,18.41 8.93,19.18 9.05,19.3 X3.A6
  Bottom 0.152: 33.31,18.29 34.84,18.29 40.68,24.13 40.8,24.01 v40.8,23.83
  Bottom 0.203: 33.31,18.29 32.3,19.3 14.2,19.3 12.81,17.92 v12.69,17.92
D-  (via drill 0.39)
  Top 0.152: 40.57,26.24 IC2.13 41.43,25.96 41.43,25.67 41.7,25.4 43.22,25.4 v43.22,24.97
  Top 0.203: X3.A7 10.96,18.8 | 10.96,18.8 11.46,18.8 v11.6,18.66 | X3.B7 10.85,19.8 10.96,19.68 10.96,18.8
  Bottom 0.152: 33,19.27 35.32,19.27 40.53,24.49 40.68,24.49 40.68,25.18 43.01,25.18 v43.22,24.97
  Bottom 0.203: 33,19.27 32.47,19.8 14.01,19.8 12.87,18.66 v11.6,18.66
DATA  (via drill 0.39)
  Top 0.152: R19.2 26.71,8.04 v26.71,6.35 | v47.03,4.46 50.59,8.03 52.85,8.03 52.99,8.18 52.99,8.46 IC2.38
  Bottom 0.152: v26.71,6.35 28.92,4.14 47.03,4.14 v47.03,4.46
DIN  (via drill 0.39)
  Top 0.152: U1.1 8.05,9.02 v8.05,9.05 | v54.65,3.81 54.65,8.85 IC2.39
  Bottom 0.152: v8.05,9.05 8.05,5.12 7.01,4.08 7.01,3.54 8.66,1.89 20.63,1.89 21.29,2.54 53.38,2.54 v54.65,3.81
EN  (via drill 0.39)
  Top 0.203: U2.3 21.65,16.48 R7.1 21.67,15.53 v21.5,15.37 | v22.33,26.64 22.9,27.2
  Bottom 0.203: v21.5,15.37 20.23,16.64 11.98,16.64 10.84,17.78 10.84,18.93 11.29,19.39 12.95,19.39 17.1,23.54 20.37,23.54 20.69,23.21 21.44,23.21 24.3,26.07 24.3,27.12 22.82,27.12 v22.33,26.64
GND  (via drill 0.39)  (22 unrouted)
  Top 0.152: C10.2 53.09,29.86 53.38,29.57 54.8,29.57 55.15,29.21 55.92,29.21 55.92,26.71 IC2.1 55.53,25.96 55.53,24.87 51.34,20.68 IC2.42 | v34.33,17.63 34.33,22.09 C9.2 32.87,25.4 | v43.22,20.32 43.58,20.68 IC2.44 IC2.41 IC2.48 49.78,15.66 55.53,9.91 55.53,9.6 IC2.40 | 32.87,25.4 C7.2 | SW1.A 27.59,14.36 | 27.59,14.36 28.47,15.24 v29.25,15.24 29.25,16.19 CONN1.1 | v29.25,11.43 29.44,11.62 C5.2 R17.1 | C2.2 22.61,20.61 | 22.61,20.61 23.85,21.85 CONN1.MT1 | C1.2 22.47,20.75 22.61,20.61 | R5.1 12.6,14.5 SW2.A' | C4.2 16.89,13.75 SW2.A SW2.A' | SW1.A' 23.29,14.16 v25.12,14.16 | v26.72,15.25 26.72,15.23 27.59,14.36 | D3.C 5.22,24.49 6.66,24.49 7.06,24.89 R8.1 8.38,24.89 9.14,25.65 11.26,25.65 11.74,25.16 11.74,24.62 11.72,24.6 11.72,24.13 | C4.2 17.82,13.96 17.82,15.37 | C4.2 18.25,13.75 18.99,13.01 20.3,13.01 C8.2 21.19,11.14 v21.63,10.7 | 32.87,25.4 33.06,25.59 33.06,26.67 30.1,26.67 R11.1 23.75,33.02 v22.9,33.02 | 22.9,44.45 C14.2 IC3.1 21.31,40.96 v21.63,40.64 | 22.9,44.45 C15.2 | v24.17,38.1 v24.17,35.56 | 22.9,44.45 23.52,43.83 23.52,42.91 23.9,42.53 24.93,42.53 26.85,44.45 v27.98,44.45 v24.59,47.84 Q2.2 24.59,50.3 23.56,51.33 23.56,52.19 24.59,53.22 R18.1 24.17,54.19 | C13.2 28.4,7.62 IC4.3 31.08,8.33 v30.22,9.19 | R21.1 22.05,8.89 v20.36,8.89 19.09,10.16 C19.2 | C11.2 33.06,5.08 v34.33,6.35 36.35,4.33 39.2,4.33 39.96,5.08 R20.1 | v20.36,7.58 20.32,7.62 C18.2 17.5,5.4 v17.82,5.08 | v15.28,3.87 15.28,4.76 C16.2 14.79,5.08 13.79,4.08 12.34,4.08 11.89,4.52 9.3,4.52 7.93,3.16 7.39,3.16 6.74,3.81 5.12,3.81 5.12,6.34 5.03,6.43 5.03,9.75 C17.2 6.39,10.94 7.39,9.94 7.39,8.78 8.2,7.98 8.59,7.98 U1.2 8.95,7.62 U1.THERMAL
  Top 0.152: U1.THERMAL 9.95,7.87 U1.15 | U1.THERMAL 9.95,7.37 U1.3 | U1.THERMAL 10.45,7.87 U1.11 | SW2.A' 13.6,13.56 v13.88,13.84
  Top 0.203: IC1.B1 25.69,24.27 C3.2
  Top 0.406: X3.B1A12 10.29,15.85 11.09,15.05 R5.1 | X3.A1B12 10.35,22.25 11.54,23.44 11.54,23.45 11.6,23.51 11.6,24 11.72,24.13 13.5,24.13 13.77,23.86 X1.1 | C1.2 20.74,21.32 19.52,22.54 R4.1 | SW1.A' 22.76,13.3 22.48,13.02 22.09,13.02 C8.2 | U2.2 19.4,15.95 18.94,15.5 18.71,15.5 18.58,15.37 17.82,15.37 16.79,15.37 C6.2 | U3.2 21.96,21.05 C2.2 | R12.1 12.32,13.28 SW2.A' | C3.2 26.34,22.85 CONN1.MT1
  Bottom 0.152: v34.33,17.63 40.53,17.63 v43.22,20.32 43.22,16.51 30.52,16.51 v29.25,15.24 v29.25,11.43 30.22,10.46 v30.22,9.19 | v25.12,14.16 25.63,14.16 v26.72,15.25 | C12.2 19.19,35.88 R6.1 | C12.2 23.22,34.3 | 23.22,34.3 24.17,34.3 | 24.17,34.3 J1.26 | v22.9,33.02 22.9,33.98 23.22,34.3 | v21.63,40.64 21.63,39.87 22.63,38.87 22.63,37.05 21.63,36.05 C12.2 | J1.25 40.37,34.3 38.44,36.22 38.44,36.8 30.79,44.45 v27.98,44.45 | J1.2 26.44,36.89 26.44,37.3 25.64,38.1 v24.17,38.1 | v24.17,35.56 24.17,34.3 | 30.44,36.7 J1.10 30.54,39.08 29.87,39.75 29.87,42.56 v27.98,44.45 | v27.98,44.45 29.25,44.45 33.04,40.66 J1.15 | v21.63,10.7 21.63,10.16 v20.36,8.89 v20.36,7.58 | IC4.3 32.09,7.62 32.44,7.26 33.42,7.26 v34.33,6.35 | v15.28,3.87 16.49,5.08 v17.82,5.08
  other vias: 25.69,20.57 6.01,21.59 6.14,17.02 27.03,21.53 29,27.94 31.79,28.45 25.44,18.35 18.71,15.11 27.66,23.62 27.09,16.51
HREF  (via drill 0.39)
  Top 0.152: v30.48,29.25 31.14,28.59 31.14,28.18 32.29,27.03 33.21,27.03 34.14,26.09 v34.14,24.13 | v33.06,20.32 33.68,19.7 33.68,17.36 35.16,15.88 IC2.22
  Bottom 0.152: J1.9 30.04,36.39 29.57,35.92 28.89,35.24 28.89,30.84 v30.48,29.25 30.52,29.21 | v34.14,24.13 34.14,21.4 v33.06,20.32
IO47_DBLTAP
  Top 0.152: C5.1 36.68,11.62 36.68,11.96 37.49,12.77 37.77,12.77 IC2.24
  Top 0.203: R17.2 C5.1
N$1
  Top 0.203: R2.1 8.4,11.73 7.05,13.08 CHG.C
N$2  (via drill 0.39)
  Top 0.152: v41.95,53.34 R9.1
  Bottom 0.152: LED1.2 38.85,54.61 39.58,55.34 40.74,55.34 40.89,55.19 40.89,54.4 v41.95,53.34
N$3  (via drill 0.39)
  Top 0.203: v21,23.95 21.01,23.93 U3.1 | R2.2 11.53,11.24 v11.53,10.54
  Bottom 0.203: v21,23.95 16.87,23.95 12.87,19.94 11.09,19.94 10.33,19.18 10.33,17.53 11.53,16.32 v11.53,10.54
N$4
  Top 0.203: U3.5 20.18,24.34 R4.2
N$5
  Top 0.203: D3.A 6.77,25.15 8.84,27.22 R10.2
N$6
  Top 0.152: Q1.1 19.68,33.02 20.36,33.02 21.21,32.17 R66.1 R11.2
N$7
  Top 0.152: Q1.3 IC3.3
N$8  (via drill 0.39)
  Top 0.203: X3.A5 10.69,20.3 v11.61,21.22 | v11.09,24.89 R8.2
  Bottom 0.203: v11.09,24.89 v11.1,24.88 11.1,21.73 v11.61,21.22
N$9
  Top 0.203: X3.B5 10.81,17.3 11.36,16.75 R5.2
N$10  (via drill 0.39)
  Top 0.152: R13.1 38.56,44.03 v38.14,44.45
  Bottom 0.152: v38.14,44.45 38.14,46.47 LED2.2
N$11  (via drill 0.39)
  Top 0.152: v19.09,54.61 20.78,52.92 R14.1
  Bottom 0.152: LED3.2 v19.09,54.61
N$12  (via drill 0.39)
  Top 0.152: v19.09,46.99 19.09,47.84 R15.1
  Bottom 0.152: LED4.2 v19.09,46.99
N$13  (via drill 0.39)
  Top 0.152: v26.71,52.07 26.71,51.22 Q2.3
  Bottom 0.152: LED1.1 40.16,53.34 | 40.16,53.34 LED2.1 | 40.16,53.34 39.62,53.88 38.08,53.88 37.93,54.03 37.93,54.82 36.57,56.19 23.96,56.19 LED3.1 | LED3.1 21.11,53.34 19.09,53.34 19.09,48.26 19.63,47.72 21.46,47.72 22.19,46.99 LED4.1 | LED3.1 24.17,54.61 v26.71,52.07
N$14
  Top 0.152: R16.1 36.87,51.52 37.62,52.28 37.62,53.56 36.58,54.61 D1.C D2.C
N$15
  Top 0.152: Q2.1 26.29,53.46 R18.2 26.71,54.61 26.71,53 27.36,52.34 27.36,51.42 27.98,50.8 34.75,50.8 R16.2
N$17  (via drill 0.39)
  Top 0.152: R21.2 25.44,8.47 R19.1 v24.17,8.89 | v35.6,7.62 IC4.6
  Bottom 0.152: v24.17,8.89 28.74,8.89 30.01,7.62 30.01,8.06 30.64,8.69 31.52,8.69 32.59,7.62 v35.6,7.62
N$18  (via drill 0.39)
  Top 0.152: U1.10 11.81,7.48 12.21,7.48 12.35,7.62 12.74,7.62 13.32,8.2 v13.32,8.31 | v10.2,3.81 9.25,2.86 FB2.1
  Bottom 0.152: v13.32,8.31 13.32,7.43 11.11,5.23 11.11,4.72 v10.2,3.81
N$19  (via drill 0.39)
  Top 0.152: v14.01,7.62 13.26,6.87 U1.9 | v11.47,3.87 11.79,3.54 11.88,3.54 12.88,2.54 FB1.1
  Bottom 0.152: v14.01,7.62 11.47,5.08 v11.47,3.87 11.47,3.81
PCLK  (via drill 0.39)
  Top 0.152: v38.09,30.43 40.58,27.94 41.95,27.94 41.95,26.71 IC2.12
  Bottom 0.152: 34.62,37.78 34.14,37.3 34.14,36.89 J1.17 34.12,36.72 34.12,33.08 35.18,32.01 36.61,32.01 38.14,30.48 v38.09,30.43
PWDN
  Bottom 0.152: R6.2 20.36,38.95 20.36,45.72 22.56,45.72 29.44,38.83 29.44,36.89 J1.8
RESET  (via drill 0.39)
  Top 0.152: v53.13,23.39 53.56,23.82 IC2.3 53.38,26.71 v53.38,27.94 | v40.68,33.02 39.41,34.29 39.41,38.1 v27.98,38.1 | TP3.P$1 v41.95,34.29
  Top 0.203: SW2.B' SW2.B 17.93,11.96 C4.1 19.55,12.05 R1.1 19.6,11.3 20.89,10.02 34.88,10.02 v35.53,10.67
  Bottom 0.152: v53.38,27.94 53.38,32.69 43.08,32.69 42.75,33.02 | 42.75,33.02 v40.68,33.02 | v27.98,38.1 28.54,37.54 J1.6 | v41.95,34.29 42.75,33.49 42.75,33.02
  Bottom 0.203: v35.53,10.67 35.53,11 35.93,11.4 41.14,11.4 v53.13,23.39
RX  (via drill 0.39)
  Top 0.152: 44.67,7.8 IC2.31 45.24,9.6 45.24,9.88 45.39,10.03 45.63,10.03 v47.03,11.43 | JP1.4 48.3,2.54 v48.3,3.81
  Bottom 0.152: v47.03,11.43 48.3,10.16 v48.3,3.81
RXD0  (via drill 0.39)
  Top 0.152: IC2.36 51.02,9.98 v50.84,10.16
  Bottom 0.152: v50.84,10.16 51.19,10.16 51.84,9.51 56.22,9.51 58.1,7.62 58.1,6.55 57.94,6.39 57.94,4.56 JP1.6
SCL  (via drill 0.39)
  Top 0.152: 38.47,24.89 IC2.15 37.71,25.4 v36.87,25.4 | 29.59,25.63 29.69,25.53 v29.69,23.81 | 27.02,26.23 27.02,27.13 26.35,27.79 26.35,28.3 v25.44,29.21
  Top 0.203: IC1.C2 26.45,25.65 27.02,26.23 29,26.23 29.59,25.63 | CONN1.4 29.62,20.55 R3.1 29.5,21.28 v29.5,21.72
  Bottom 0.152: v36.87,25.4 30.52,25.4 29.69,24.57 v29.69,23.81 | J1.5 28.04,31.81 v25.44,29.21
  Bottom 0.203: v29.5,21.72 29.5,23.62 v29.69,23.81
SD_MODE
  Top 0.152: U1.4 6.82,6.87 R22.1
SDA  (via drill 0.39)
  Top 0.152: v51.09,23.62 52.29,24.82 IC2.4 | v30.76,27.32 26.71,31.37 v26.71,33.02
  Top 0.203: IC1.C1 26.91,25.15 27.47,25.72 28.53,25.72 v28.74,25.51 | CONN1.3 28.94,19.55 29.35,19.96 R3.2 30.71,19.96 30.71,21.49 v30.48,21.72
  Bottom 0.152: 49.06,25.65 v51.09,23.62 | 31.79,26.11 30.76,27.15 v30.76,27.32 | J1.3 26.94,36.7 26.94,36.29 26.71,36.06 v26.71,33.02
  Bottom 0.203: 49.06,25.65 41.17,25.65 40.71,26.11 31.79,26.11 30.34,26.11 29.57,25.34 29.19,25.34 | v28.74,25.51 28.8,25.51 28.97,25.34 29.19,25.34 | 29.19,25.34 29.19,24.33 28.83,23.97 28.83,21.37 29.16,21.04 30.17,21.04 30.48,21.35 v30.48,21.72
SELECT  (via drill 0.39)
  Top 0.152: IC4.2 32.67,8.85 32.67,8.93 32.92,9.17 v35.6,9.17 | v35.6,6.35 37.29,6.35 38.35,5.29 | 38.35,5.29 R20.2 | IC2.34 47.91,8.46 47.91,8.18 46.09,6.35 39.41,6.35 38.35,5.29
  Bottom 0.152: v35.6,9.17 35.6,8.54 36.25,7.89 36.25,7.35 35.6,6.7 v35.6,6.35
STROBE  (via drill 0.39)
  Top 0.152: v25.44,35.56 25.44,39.37 v26.71,39.37 | v25.44,40.68 26.75,40.68 D1.A
  Bottom 0.152: J1.1 26.04,36.16 v25.44,35.56 | v26.71,39.37 25.44,40.64 v25.44,40.68
TX  (via drill 0.39)
  Top 0.152: 45.76,8.85 IC2.32 46.51,9.6 46.51,9.88 48.05,11.43 v49.57,11.43 | JP1.5 50.84,2.54 50.84,3.81 v49.57,3.81
  Bottom 0.152: v49.57,11.43 v49.57,3.81
TXD0  (via drill 0.39)
  Top 0.152: IC2.37 52.29,9.98 v52.11,10.16
  Bottom 0.152: v52.11,10.16 58.46,10.16 58.46,6.4 | 58.3,6.24 58.46,6.4 | 58.46,6.4 58.46,5.13 58.3,4.97 58.3,2.38 JP1.7
VBAT
  Top 0.305: Q3.3 15.33,19.21 15.33,21.64 15.66,21.97 15.66,23.18 X1.2 | U3.3 23.51,22.58 24.29,23.37 24.42,23.37 C3.1 24.44,25.86 24.73,26.15 IC1.A3
  Top 0.406: X1.2 15.77,25 16.42,25.65 19.92,25.65 20.61,26.35 20.61,26.29 21.44,26.29 21.79,25.93 21.79,24.41 22.91,23.29 U3.3
VBUS  (via drill 0.48)
  Top 0.305: X3.B4A9 9.5,16.65 9.14,17.01 8.04,17.01 | 8.04,17.01 8.04,16.62 7.7,16.28 7.7,14.66 7.98,14.38 7.98,13.83 | 8.04,17.01 8.04,20 9.5,21.45 X3.A4B9 10.7,21.45 12.09,22.85 12.12,22.85 v12.37,23.1 12.69,22.78 12.69,20.5 13.48,19.71 D4.A 13.48,16.31 Q3.1 | 4.56,13.34 5.06,13.83 7.98,13.83 | 7.98,13.83 8.12,13.83 8.66,13.28 R12.2
  Top 0.406: CHG.A 4.56,13.34 | U3.4 22.91,25.77 v23.52,26.38 23.66,26.52 23.66,29.97
  Bottom 0.406: v23.52,26.38 22.04,24.89 17.06,24.89 15.27,23.1 v12.37,23.1
VHI
  Top 0.305: D4.C 16.79,19.22 C6.1 | C6.1 16.54,17.96 15.2,16.62 Q3.2 | C6.1 17.26,17.96 18.45,16.77 U2.1 18.45,17.26 18.71,17.53 22.33,17.53 23.36,16.5 R7.2 23.37,15.6 23.66,15.3 25.63,15.3 26.01,14.92 26.01,13.05 26.22,12.85 27.44,12.85 27.46,12.86 27.48,12.86
VO+  (via drill 0.39)
  Top 0.152: FB1.2 v17.82,2.54 | v20.36,2.54 21.59,3.77 J2.2 20.52,3.81 19.51,4.82 19.41,4.82 v19.09,5.14 | C19.1 15.77,10.16 16.78,11.16 18.23,11.16 18.58,10.81 v19.09,10.81
  Bottom 0.152: v17.82,2.54 v20.36,2.54 | v19.09,10.81 v19.09,5.14
VO-
  Top 0.152: FB2.2 11.33,2.54 13.54,0.33 17.82,0.33 19.09,1.6 J2.1 16.55,3.81 15.83,4.53 15.83,5.94 15.6,6.17 C18.1
VSYNC  (via drill 0.39)
  Top 0.152: v27.98,39.37 40.68,39.37 40.68,34.29 42.86,32.11 44.64,32.11 44.99,31.75 48.65,31.75 49.44,32.55 56.51,32.55 57.35,31.71 57.35,16.67 v57.19,16.51 | v47.03,15.24 v43.22,15.24 | v40.68,15.24 40.05,14.61 IC2.23
  Bottom 0.152: J1.7 29.04,38.31 v27.98,39.37 | v57.19,16.51 55.92,15.24 v47.03,15.24 | v43.22,15.24 v40.68,15.24
WS  (via drill 0.39)
  Top 0.152: 38.14,8.52 38.54,8.52 39.62,7.44 45.91,7.44 46.64,8.18 46.64,8.46 IC2.33 | 38.14,8.52 IC4.1 | U1.14 10.34,9.23 10.34,9.62 10.2,9.77 v10.2,10.16 | 38.14,8.52 38.18,8.48 v38.18,6.39 | v41.95,3.49 39.73,1.27 v38.14,1.27
  Bottom 0.152: v10.2,10.16 8.93,10.16 7.66,11.43 5.12,11.43 5.12,2.54 6.39,1.27 v38.14,1.27 | v41.95,3.49 42.25,3.79 47.28,3.79 47.68,4.19 47.68,4.74 46.03,6.39 v38.18,6.39
XVCLK  (via drill 0.39)
  Top 0.152: v35.21,29.28 35.51,28.98 35.51,22.23 37.49,20.25 37.77,20.25 IC2.19
  Bottom 0.152: v35.21,29.28 34.47,30.02 34.28,30.02 32.04,32.27 J1.13

### Text on the board
tPlace: SDA | SCL | #13 | I2C | ESP32S3 | Reset | Boot | Neo | Chg